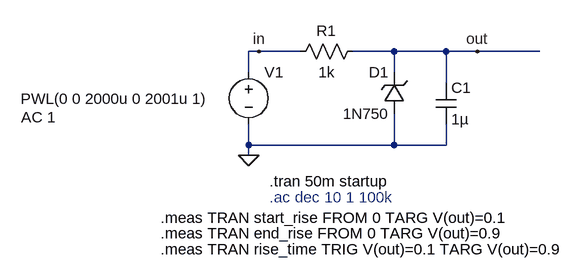
[diagram p0: schematic rc_schematic.asc]
rc_schematic.asc, the LTspice schematic file:
Version 4.1
SHEET 1 880 680
WIRE 80 64 64 64
WIRE 144 64 80 64
WIRE 288 64 224 64
WIRE 368 64 288 64
WIRE 416 64 368 64
WIRE 512 64 416 64
WIRE 64 96 64 64
WIRE 288 96 288 64
WIRE 368 112 368 64
WIRE 64 208 64 176
WIRE 288 208 288 160
WIRE 288 208 64 208
WIRE 368 208 368 176
WIRE 368 208 288 208
WIRE 64 224 64 208
FLAG 64 224 0
FLAG 416 64 out
FLAG 80 64 in
SYMBOL cap 352 112 R0
SYMATTR InstName C1
SYMATTR Value 1µ
SYMBOL res 240 48 R90
WINDOW 0 0 56 VBottom 2
WINDOW 3 32 56 VTop 2
SYMATTR InstName R1
SYMATTR Value 1k
SYMBOL voltage 64 80 R0
WINDOW 3 -351 57 Left 2
WINDOW 123 -350 85 Left 2
WINDOW 39 0 0 Left 0
SYMATTR Value PWL(0 0 2000u 0 2001u 1)
SYMATTR Value2 AC 1
SYMATTR InstName V1
SYMBOL zener 304 160 R180
WINDOW 0 24 64 Left 2
WINDOW 3 24 0 Left 2
SYMATTR InstName D1
SYMATTR Value 1N750
TEXT 96 264 Left 2 !.tran 50m startup
TEXT 96 288 Left 2 ;.ac dec 10 1 100k
TEXT -72 320 Left 2 !.meas TRAN start_rise FROM 0 TARG V(out)=0.1
TEXT -72 344 Left 2 !.meas TRAN end_rise FROM 0 TARG V(out)=0.9
TEXT -72 368 Left 2 !.meas TRAN rise_time TRIG V(out)=0.1 TARG V(out)=0.9

The netlist it stands for:
* rc_schematic.asc
C1 out 0 1µ
R1 out in 1k
V1 in 0 PWL(0 0 2000u 0 2001u 1) AC 1
D1 0 out 1N750
.model D D
.lib standard.dio
.tran 50m startup
* .ac dec 10 1 100k
.meas TRAN start_rise FROM 0 TARG V(out)=0.1
.meas TRAN end_rise FROM 0 TARG V(out)=0.9
.meas TRAN rise_time TRIG V(out)=0.1 TARG V(out)=0.9
.backanno
.end